# Altium schematic sheet Blok Diagram.SchDoc: B001AA Main Block Diagram
size 292 x 193 mm; SheetNumber: 1; SheetTotal: 28
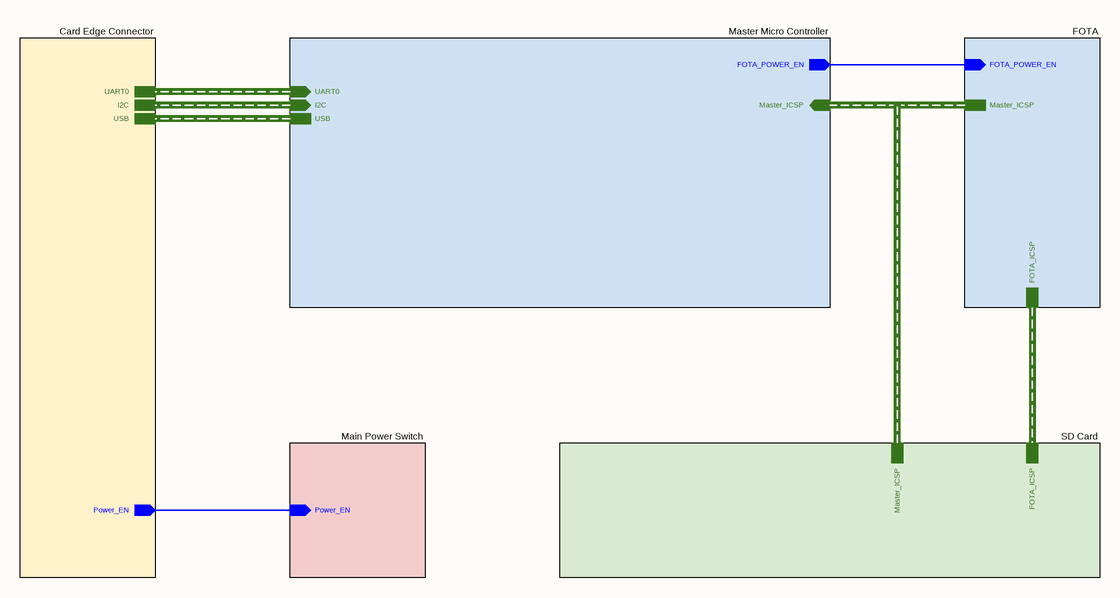
[diagram p0: Blok Diagram.SchDoc]

## Sub-sheets
Card Edge Connector = Card Edge Connector.SchDoc: I2C (harness I2C), UART0 (harness UART0), USB (harness USB), Power_EN (out)
FOTA = FOTA.SchDoc: FOTA_ICSP (harness FOTA_ICSP), Master_ICSP (harness Master_ICSP), FOTA_POWER_EN (in)
Main Power Switch = Power Switch.SchDoc: Power_EN (in)
Master Micro Controller = Master Micro Controller.SchDoc: UART0 (in, harness UART0), I2C (in, harness I2C), Master_ICSP (in, harness Master_ICSP), FOTA_POWER_EN (out), USB (harness USB)
SD Card = SD Card Block.SchDoc: Master_ICSP (harness Master_ICSP), FOTA_ICSP (harness FOTA_ICSP)

## Nets
(unnamed): sheet Card Edge Connector/Power_EN, sheet Main Power Switch/Power_EN
(unnamed): sheet FOTA/FOTA_POWER_EN, sheet Master Micro Controller/FOTA_POWER_EN

## Buses and harness runs
harness sheet Card Edge Connector/I2C = sheet Master Micro Controller/I2C
harness sheet Card Edge Connector/UART0 = sheet Master Micro Controller/UART0
harness sheet Card Edge Connector/USB = sheet Master Micro Controller/USB
harness sheet FOTA/FOTA_ICSP = sheet SD Card/FOTA_ICSP
harness sheet FOTA/Master_ICSP = sheet Master Micro Controller/Master_ICSP = sheet SD Card/Master_ICSP

## Notes on the sheet
- © 2021 All rights reserved.
  This document may not, in whole or in part, be copied, photocopied, reproduced, translated or converted to any electronic or machine readable from without prior written permission of Mehmet Günce Akkoyun.
  Engineer contact : akkoyun@me.com
- Property of
- Engineer :
- Date :
- Size :
- A4
- Time :
- Project :
- Page :
- /
- Customer :
- Product ID :
- Module ID :
- Version :
- File :
- Revision :